# Altium project PortiloopV2Altium_Project.PrjPcb
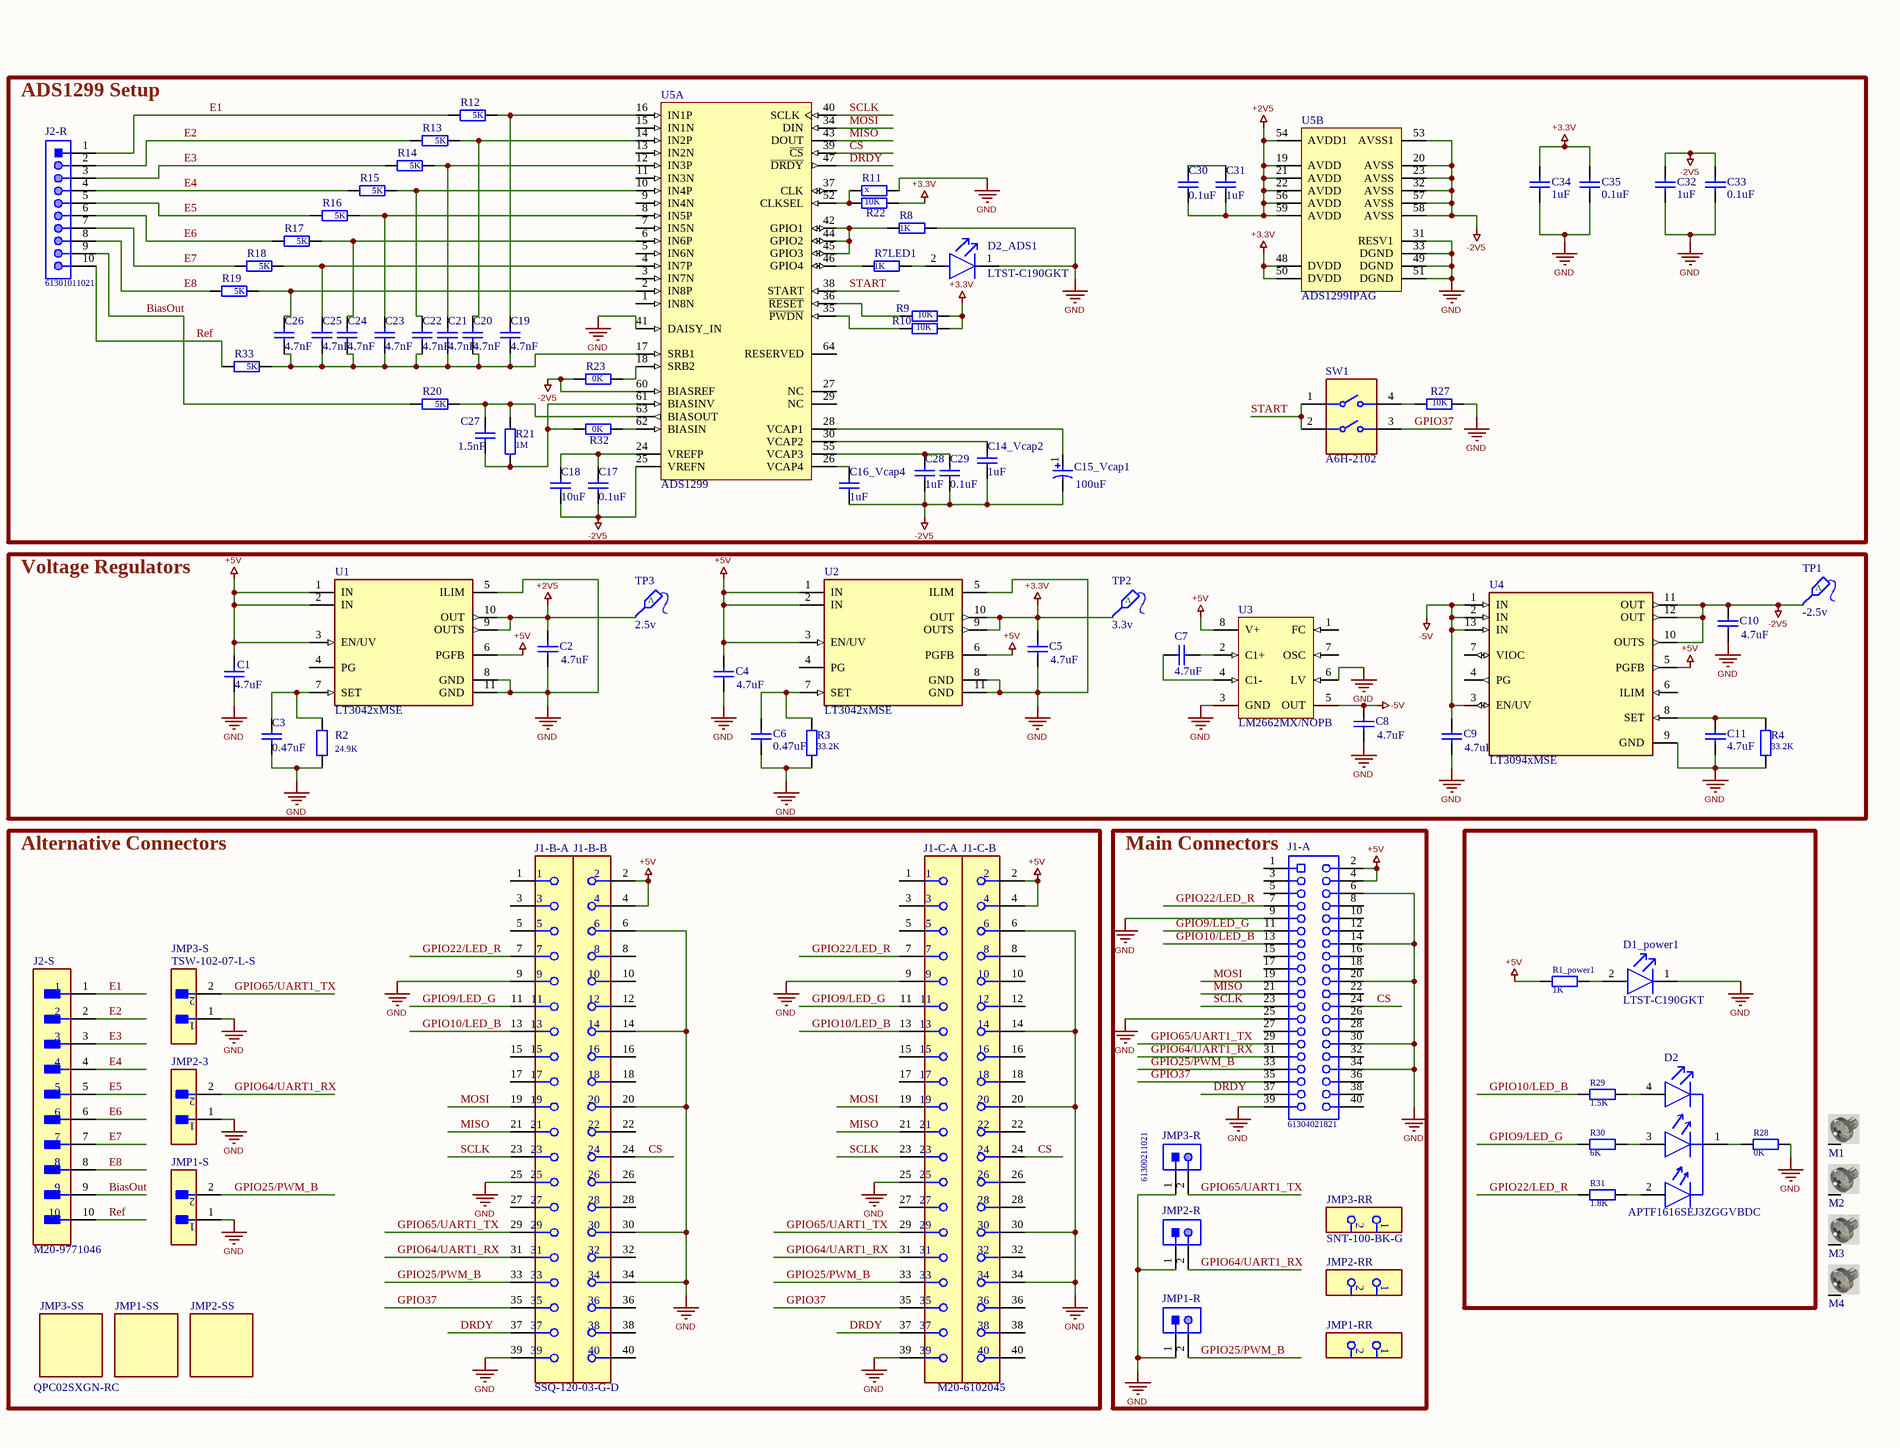
[diagram p0: PortiloopV2Altium_Sch.SchDoc, right]
1 sheet, 94 parts. Net scope: global (net labels, ports and power ports of the same name join across sheets).
Board file: PortiloopV2Altium_PCB.PcbDoc

## Sheet PortiloopV2Altium_Sch.SchDoc
size A3; DrawnBy: Ehsan Marjani; Organization: MIST Lab; SheetNumber: 1; SheetTotal: 1; SPICEModelCacheKUFEERRC: <root> / <DocumentId>KUFEERRC</DocumentId> / <CacheFrame Number="0"> / <Model Name="cap" Kind="MDL"> / <Text>*Default semiconductor capacitor / .MODEL CAP C()</Text> / </Model> / </CacheFrame> / </root>

### Parts
C1  value 4.7uF  [C1206]  (hidden comment: 4.7mkf)
C2  value 4.7uF  [C1206]  (hidden comment: 4.7mkf)
C3  value 0.47uF  [1608[0603]]  (hidden comment: 0.47mkf)
C4  value 4.7uF  [C1206]  (hidden comment: 4.7mkf)
C5  value 4.7uF  [C1206]  (hidden comment: 4.7mkf)
C6  value 0.47uF  [1608[0603]]  (hidden comment: 0.47mkf)
C7  value 4.7uF  [C1206]  (hidden comment: 4.7mkf)
C8  value 4.7uF  [C1206]  (hidden comment: 4.7mkf)
C9  value 4.7uF  [C1206]  (hidden comment: 4.7mkf)
C10  value 4.7uF  [C1206]  (hidden comment: 4.7mkf)
C11  value 4.7uF  [C1206]  (hidden comment: 4.7mkf)
C14_Vcap2  value 1uF  [1608[0603]]  (hidden comment: 1mkf)
C15_Vcap1  Capacitance: 100uF  [KEMT-T491-D_M]  (hidden comment: 100mkf)
C16_Vcap4  value 1uF  [1608[0603]]  (hidden comment: 1mkf)
C17  value 0.1uF  [1608[0603]]  (hidden comment: 0.1mkf)
C18  value 10uF  [C1206]  (hidden comment: 10mkf)
C19  4.7nf  [1608[0603]]
C20  4.7nf  [1608[0603]]
C21  4.7nf  [1608[0603]]
C22  4.7nf  [1608[0603]]
C23  4.7nf  [1608[0603]]
C24  4.7nf  [1608[0603]]
C25  4.7nf  [1608[0603]]
C26  4.7nf  [1608[0603]]
C27  1.5nf  [1608[0603]]
C28  value 1uF  [1608[0603]]  (hidden comment: 1mkf)
C29  value 0.1uF  [1608[0603]]  (hidden comment: 0.1mkf)
C30  value 0.1uF  [1608[0603]]  (hidden comment: 0.1mkf)
C31  value 1uF  [1608[0603]]  (hidden comment: 1mkf)
C32  value 1uF  [1608[0603]]  (hidden comment: 1mkf)
C33  value 0.1uF  [1608[0603]]  (hidden comment: 0.1mkf)
C34  value 1uF  [1608[0603]]  (hidden comment: 1mkf)
C35  value 0.1uF  [1608[0603]]  (hidden comment: 0.1mkf)
D1_power1  LTST-C190GKT  [FP-LTST-C190GKT-MFG]
D2  APTF1616SEJ3ZGGVBDC  [FP-APTF1616SEJ3ZGGVBDC-MFG]
D2_ADS1  LTST-C190GKT  [FP-LTST-C190GKT-MFG]
J1-A  61304021821  [61304021821]
J1-B-  SSQ-120-03-G-D  [FP-SSQ-120-03-G-D-MFG]  (parts A,B of 2)
J1-C-  M20-6102045  [FP-M20-6102045-MFG]  (value not drawn)  (parts A,B of 2)
J2-R  61301011021  [61301011021]
J2-S  M20-9771046  [FP-M20-9771046-MFG]
JMP1-R  61300211021  [61300211021]  (value not drawn)
JMP1-RR  SNT-100-BK-G  [FP-SNT-100-BK-G-MFG]  (value not drawn)
JMP1-S  TSW-102-07-L-S  [FP-TSW-102-07-L-S-MFG]  (value not drawn)
JMP1-SS  QPC02SXGN-RC  [FP-QPC02SXGN-RC-MFG]  (value not drawn)
JMP2-3  TSW-102-07-L-S  [FP-TSW-102-07-L-S-MFG]  (value not drawn)
JMP2-R  61300211021  [61300211021]  (value not drawn)
JMP2-RR  SNT-100-BK-G  [FP-SNT-100-BK-G-MFG]  (value not drawn)
JMP2-SS  QPC02SXGN-RC  [FP-QPC02SXGN-RC-MFG]  (value not drawn)
JMP3-R  61300211021  [61300211021]
JMP3-RR  SNT-100-BK-G  [FP-SNT-100-BK-G-MFG]
JMP3-S  TSW-102-07-L-S  [FP-TSW-102-07-L-S-MFG]
JMP3-SS  QPC02SXGN-RC  [FP-QPC02SXGN-RC-MFG]
M1  Screw  [Board Screw_No Silk]  (value not drawn)
M2  Screw  [Board Screw_No Silk]  (value not drawn)
M3  Screw  [Board Screw_No Silk]  (value not drawn)
M4  Screw  [Board Screw_No Silk]  (value not drawn)
R1_power1  1K  [1608[0603]]
R2  24.9K  [1608[0603]]
R3  33.2K  [1608[0603]]
R4  33.2K  [1608[0603]]
R7LED1  1K  [1608[0603]]
R8  1K  [1608[0603]]
R9  10K  [1608[0603]]
R10  10K  [1608[0603]]
R11  x  [1608[0603]]
R12  5K  [1608[0603]]
R13  5K  [1608[0603]]
R14  5K  [1608[0603]]
R15  5K  [1608[0603]]
R16  5K  [1608[0603]]
R17  5K  [1608[0603]]
R18  5K  [1608[0603]]
R19  5K  [1608[0603]]
R20  5K  [1608[0603]]
R21  1M  [1608[0603]]
R22  10K  [1608[0603]]
R23  0K  [1608[0603]]
R27  10K  [1608[0603]]
R28  0K  [1608[0603]]
R29  1.5K  [1608[0603]]
R30  6K  [1608[0603]]
R31  1.8K  [1608[0603]]
R32  0K  [1608[0603]]
R33  5K  [1608[0603]]
SW1  A6H-2102  [FP-A6H-2102-MFG]
TP1  -2.5v  [TESTPOINT1]
TP2  3.3v  [TESTPOINT1]
TP3  2.5v  [TESTPOINT1]
U1  LT3042xMSE  [FP-MSE-10-05-08-1664-IPC_C]
U2  LT3042xMSE  [FP-MSE-10-05-08-1664-IPC_C]
U3  LM2662MX/NOPB  [D0008A_M]
U4  LT3094xMSE  [FP-MSE-12-05-08-1666-IPC_A]
U5  ADS1299  [PAG0064A_M]  (parts A,B of 2)

### Blocks framed on the sheet
ADS1299 Setup: C14_Vcap2 C15_Vcap1 C16_Vcap4 C17-C35 D2_ADS1 J2-R R7LED1 R8-R23 R27 R32 R33 SW1 U5
Voltage Regulators: C1-C11 R2-R4 TP1-TP3 U1-U4
Alternative Connectors: J1-B- J1-C- J2-S JMP1-S JMP1-SS JMP2-3 JMP2-SS JMP3-S JMP3-SS
Main Connectors: J1-A JMP1-R JMP1-RR JMP2-R JMP2-RR JMP3-R JMP3-RR

### Nets
+2V5: C2.2 C30.2 C31.2 TP3.1(T) U1.9(OUTS) U1.10(OUT) U5.19(AVDD) U5.21(AVDD) U5.22(AVDD) U5.54(AVDD1) U5.56(AVDD) U5.59(AVDD)
+3.3V: C5.2 C34.2 C35.2 R9.1 R10.1 R22.1 TP2.1(T) U2.9(OUTS) U2.10(OUT) U5.48(DVDD) U5.50(DVDD)
+5V: C1.2 C4.2 J1-A.2 J1-A.4 J1-B-.2 J1-B-.4 J1-C-.2 J1-C-.4 R1_power1.2 U1.1(IN) U1.2(IN) U1.3(EN/UV) U1.6(PGFB) U2.1(IN) U2.2(IN) U2.3(EN/UV) U2.6(PGFB) U3.8(V+) U4.5(PGFB)
-2V5: C10.2 C14_Vcap2.1 C15_Vcap1.2 C16_Vcap4.1 C17.2 C18.1 C28.1 C29.1 C32.2 C33.2 R23.2 TP1.1(T) U4.10(OUTS) U4.11(OUT) U4.12(OUT) U5.20(AVSS) U5.23(AVSS) U5.25(VREFN) U5.32(AVSS) U5.53(AVSS1) U5.57(AVSS) U5.58(AVSS) U5.60(BIASREF)
-5V: C8.2 C9.2 U3.5(OUT) U4.1(IN) U4.2(IN) U4.3(EN/UV) U4.13(IN)
GND: C1.1 C2.1 C3.1 C4.1 C5.1 C6.2 C8.1 C9.1 C10.1 C11.1 C32.1 C33.1 C34.1 C35.1 D1_power1.1(C) D2_ADS1.1(C) J1-A.6 J1-A.9 J1-A.14 J1-A.20 J1-A.25 J1-A.30 J1-A.34 J1-A.39 J1-B-.6 J1-B-.9 J1-B-.14 J1-B-.20 J1-B-.25 J1-B-.30 J1-B-.34 J1-B-.39 J1-C-.6 J1-C-.9 J1-C-.14 J1-C-.20 J1-C-.25 J1-C-.30 J1-C-.34 J1-C-.39 JMP1-R.1 JMP1-S.1 JMP2-3.1 JMP2-R.1 JMP3-R.1 JMP3-S.1 R2.2 R3.2 R4.2 R8.2 R11.1 R27.1 R28.1 U1.5(ILIM) U1.8(GND) U1.11(GND) U2.5(ILIM) U2.8(GND) U2.11(GND) U3.3(GND) U3.6(LV) U4.9(GND) U5.31(RESV1) U5.33(DGND) U5.41(DAISY_IN) U5.49(DGND) U5.51(DGND)
BiasOut: J2-R.9 J2-S.9 R20.1
CS: J1-A.24 J1-B-.24 J1-C-.24 U5.39(~{CS})
DRDY: J1-A.37 J1-B-.37 J1-C-.37 U5.47(~{DRDY})
E1: J2-R.1 J2-S.1 R12.1
E2: J2-R.2 J2-S.2 R13.1
E3: J2-R.3 J2-S.3 R14.1
E4: J2-R.4 J2-S.4 R15.1
E5: J2-R.5 J2-S.5 R16.1
E6: J2-R.6 J2-S.6 R17.1
E7: J2-R.7 J2-S.7 R18.1
E8: J2-R.8 J2-S.8 R19.1
GPIO9/LED_G: J1-A.11 J1-B-.11 J1-C-.11 R30.2
GPIO10/LED_B: J1-A.13 J1-B-.13 J1-C-.13 R29.2
GPIO22/LED_R: J1-A.7 J1-B-.7 J1-C-.7 R31.2
GPIO25/PWM_B: J1-A.33 J1-B-.33 J1-C-.33 JMP1-R.2 JMP1-S.2
GPIO37: J1-A.35 J1-B-.35 J1-C-.35 SW1.3
GPIO64/UART1_RX: J1-A.31 J1-B-.31 J1-C-.31 JMP2-3.2 JMP2-R.2
GPIO65/UART1_TX: J1-A.29 J1-B-.29 J1-C-.29 JMP3-R.2 JMP3-S.2
MISO: J1-A.21 J1-B-.21 J1-C-.21 U5.43(DOUT)
MOSI: J1-A.19 J1-B-.19 J1-C-.19 U5.34(DIN)
Ref: J2-R.10 J2-S.10 R33.1
SCLK: J1-A.23 J1-B-.23 J1-C-.23 U5.40(SCLK)
START: SW1.1 SW1.2 U5.38(START)
NetC3_2: C3.2 R2.1 U1.7(SET)
NetC6_1: C6.1 R3.1 U2.7(SET)
NetC7_1: C7.1 U3.4(C1-)
NetC7_2: C7.2 U3.2(C1+)
NetC11_2: C11.2 R4.1 U4.8(SET)
NetC14_Vcap2_2: C14_Vcap2.2 U5.30(VCAP2)
NetC15_Vcap1_1: C15_Vcap1.1 U5.28(VCAP1)
NetC16_Vcap4_2: C16_Vcap4.2 U5.26(VCAP4)
NetC17_1: C17.1 C18.2 U5.24(VREFP)
NetC19_1: C19.1 C20.1 C21.1 C22.1 C23.1 C24.1 C25.1 C26.1 R33.2 U5.17(SRB1)
NetC19_2: C19.2 R12.2 U5.16(IN1P)
NetC20_2: C20.2 R13.2 U5.14(IN2P)
NetC21_2: C21.2 R14.2 U5.12(IN3P)
NetC22_2: C22.2 R15.2 U5.10(IN4P)
NetC23_2: C23.2 R16.2 U5.8(IN5P)
NetC24_2: C24.2 R17.2 U5.6(IN6P)
NetC25_2: C25.2 R18.2 U5.4(IN7P)
NetC26_2: C26.2 R19.2 U5.2(IN8P)
NetC27_1: C27.1 R21.2 R32.2 U5.61(BIASINV)
NetC27_2: C27.2 R20.2 R21.1 U5.63(BIASOUT)
NetC28_2: C28.2 C29.2 U5.55(VCAP3)
NetC30_1: C30.1 C31.1
NetD1_power1_2: D1_power1.2(A) R1_power1.1
NetD2_1: D2.1(COMMON_CATHODE) R28.2
NetD2_2: D2.2(RED_A) R31.1
NetD2_3: D2.3(GREEN_A) R30.1
NetD2_4: D2.4(BLUE_A) R29.1
NetD2_ADS1_2: D2_ADS1.2(A) R7LED1.2
NetR7LED1_1: R7LED1.1 U5.46(GPIO4)
NetR8_1: R8.1 U5.42(GPIO1) U5.44(GPIO2) U5.45(GPIO3)
NetR9_2: R9.2 U5.36(~{RESET})
NetR10_2: R10.2 U5.35(~{PWDN})
NetR11_2: R11.2 R22.2 U5.52(CLKSEL)
NetR23_1: R23.1 U5.18(SRB2)
NetR27_2: R27.2 SW1.4
NetR32_1: R32.1 U5.62(BIASIN)

Not connected (* = marked no-connect by the designer): J1-A 1 3 5 8 10 12 15 16 17 18 22 26 27 28 32 36 38 40; J1-B- 1 3 5 8 10 12 15 16 17 18 22 26 27 28 32 36 38 40; J1-C- 1 3 5 8 10 12 15 16 17 18 22 26 27 28 32 36 38 40; M1 S; M2 S; M3 S; M4 S; U1 4(PG); U2 4(PG); U3 1(FC) 7(OSC); U4 4(PG) 6(ILIM) 7(VIOC); U5 1(IN8N) 3(IN7N) 5(IN6N) 7(IN5N) 9(IN4N) 11(IN3N) 13(IN2N) 15(IN1N) 27(NC) 29(NC) 37(CLK) 64(RESERVED)

### Notes on the sheet
- (in symbol Test Point) v

### Library data of the parts
C1-C11 C14_Vcap2 C16_Vcap4 C17-C35 = Cap Semi: Published: 8-Jun-2000; LatestRevisionDate: 29-May-2009; LatestRevisionNote: IPC-7351 Footprint Added.; PackageReference: C1206; Publisher: Altium Limited; PackageDescription: Chip Capacitor
  C19-C26: Value: 4.7nF
  C27: Value: 1.5nF
C15_Vcap1 = CMP-1664-00011-1: Capacitor, Tantalum, 100 uF, +/- 10%, -55 to 125 degC, 2-Pin SMD, RoHS, Tape and Reel; Voltage Rating: 50 V; Case\Package: Radial; Tolerance: 20%; Lead Pitch: 2 mm; PackageReference: T491-D; REACH SVHC: No SVHC; Diameter: 5 mm; Pins: 2; PackageDescription: 2-Pin Surface Mount Device, Body 7.3 x 4.3 mm; ComponentLink1URL: http://www.kemet.com/; ComponentLink2URL: http://www.kemet.com/Lists/ProductCatalog/Attachments/254/KEM_T2005_T491.pdf; Packaging: Bulk; DatasheetVersion: Jun-16; Radiation Hardening: No; Voltage Rating (DC): 50 V; ComponentLink2Description: Datasheet; Height: 11 mm; RoHSCompliant: true; Min Operating Temperature: -40 degC; Mount: Through Hole; Max Operating Temperature: 85 degC; Package Quantity: 200; Length: 11 mm; ComponentLink1Description: Manufacturer URL
D1_power1 D2_ADS1 = CMP-22017-000005-2: LED GREEN CLEAR CHIP SMD; Dominant Wavelength: 569nm; Reverse Voltage: 5V; Lens Color: Colorless; Viewing Angle: 130°; Voltage: 2V; Forward Current: 30mA; Power Dissipation: 100mW; Luminous Intensity: 6mcd; Number of LEDs: 1; Forward Voltage: 2.1V; Wavelength: 565nm; Test Current: 10mA; Min Operating Temperature: -55°C; Lens Style: Clear; Mount: Surface Mount; Width: 0.8mm; Packaging: Tape and Reel; Lens Transparency: Clear; Case Code (Metric): 1608; Depth: 0.8mm; Case Code (Imperial): 0603; Case/Package: 0603; Number of Pins: 2; Max Operating Temperature: 85°C; Lead Free: Lead Free; Number of Elements: 1; Length: 1.6mm; Height: 0.8mm; Package Quantity: 1; Power Rating: 100mW; Radiation Hardening: No; Illumination Color: Green; Color: Green
D2 = CMP-44529-000025-1: LED RGB CLEAR 4SMD; Luminous Intensity: 140mcd; Test Current: 20mA; Forward Voltage: 3.3V; Lens Color: Colorless; Illumination Color: Blue; Viewing Angle: 120°; Dominant Wavelength: 470nm; Width: 1.6mm; Mount: Surface Mount; Height: 0.9mm; Case/Package: 0606; Max Operating Temperature: 85°C; Color: Blue; Lens Transparency: Clear; Min Operating Temperature: -40°C; Forward Current: 20mA; Length: 1.6mm; Packaging: Tape and Reel; Package Quantity: 2000
J1-A = CMP-1502-01370-1: THT Vertical Socket Header WR-PHD, Pitch 2.54 mm, Dual Row, 40 pins; Manufacturer: Wurth Elektronik; Pitch: 2.54mm; Withstanding Voltage: 500VAC; Rated Current: 3A; Gender: Female; Working Voltage: 250VAC; Pin Number: 40; Contact Resistance: 20mOhm; Datasheet URL: https://katalog.we-online.de/em/datasheet/6130xx21821.pdf; Operating Temperature: -40to125degC; Row Number: Dual; Mounting Technology: THT; Package Reference: 61304021821; Orientation: Vertical; Part Number: 61304021821; Manufacturer URL: http://www.we-online.de; Publisher: WurthElektronik; Packaging: Tray
J1-B- = CMP-02766-001530-1: CONN RCPT 40POS 0.1 GOLD PCB; Pitch: 0.1inch; Connector Type: Receptacle; Number of Contacts: 40; Contact Resistance: 10mR; Max Voltage Rating (AC): 550V; Gender: Female; Max Current Rating: 7.6A; RoHS Compliant: Yes; Contact Material: Bronze; Length: 51.31mm; Lead Free: Lead Free; Depth: 4.95mm; Width: 4.95mm; Packaging: Bulk; Mount: Through Hole; Contact Plating: Gold; Orientation: Straight; Contact Type: Female Socket; Min Operating Temperature: -55°C; Color: Black; Max Operating Temperature: 125°C; Radiation Hardening: No; Row Spacing: 0.1inch; Number of Positions: 40; Housing Material: Polymer; Termination: Solder; Housing Color: Black; Number of Rows: 2; Series: SSQ
J1-C- = CMP-15831-000080-1: CONN STKTHRU PC/104 40POS PCB; Current Rating: 3A; Pitch: 2.54mm; Insulation Resistance: 5GR; Contact Resistance: 30mR; Number of Positions: 40; Gender: Receptacle; REACH SVHC: No SVHC; Housing Material: Nylon; Number of Rows: 2; Min Operating Temperature: -55°C; Contact Plating: Gold; Orientation: Straight; Mount: Through Hole; Contact Material: Bronze; Length: 51.46mm; Weight: 0.218205oz; Number of Contacts: 40; Packaging: Rail/Tube; Depth: 5.25mm; Termination: Solder; Radiation Hardening: No; Flammability Rating: UL94 V-0; Housing Color: Black; Max Operating Temperature: 105°C; Material: Nylon; Package Quantity: 11; Color: Black; Max Current Rating: 3A; Series: M20
J2-R = CMP-1502-01081-1: THT Angled Pin Header WR-PHD, Pitch 2.54 mm, Single Row, 10 pins; Manufacturer: Wurth Elektronik; Contact Resistance: 20mOhm; Pitch: 2.54mm; Gender: Male; Withstanding Voltage: 500VAC; Rated Current: 3A; Working Voltage: 250VAC; Pin Number: 10; Manufacturer URL: http://www.we-online.de; Package Reference: 61301011021; Publisher: WurthElektronik; Part Number: 61301011021; Datasheet URL: https://katalog.we-online.de/em/datasheet/6130xx11021.pdf; Packaging: Bag; Row Number: Single; Orientation: Angled; Mounting Technology: THT; Operating Temperature: -40to105degC
J2-S = CMP-15831-000029-1: CONN HEADER VERT 10POS 2.54MM; Gender: Male; Number of Positions: 10; Connector Type: Male Pin; Voltage Rating: 750V; Current Rating: 3A; Contact Plating: Tin; Mount: Through Hole; Radiation Hardening: No; Packaging: Bulk; Pitch: 2.54mm; Number of Rows: 1; Series: M20; Contact Type: Male Pin; Color: Black; Package Quantity: 500; Contact Mating Length: 0.228inch; Case/Package: SIL; Termination: Solder; Number of Contacts: 10; Housing Material: Nylon; Contact Material: Brass
JMP1-R JMP2-R JMP3-R = CMP-1502-01059-1: THT Angled Pin Header WR-PHD, Pitch 2.54 mm, Single Row, 2 pins; Manufacturer: Wurth Elektronik; Withstanding Voltage: 500VAC; Gender: Male; Pitch: 2.54mm; Pin Number: 2; Rated Current: 3A; Contact Resistance: 20mOhm; Working Voltage: 250VAC; Mounting Technology: THT; Part Number: 61300211021; Manufacturer URL: http://www.we-online.de; Operating Temperature: -40to105degC; Row Number: Single; Publisher: WurthElektronik; Orientation: Angled; Datasheet URL: https://katalog.we-online.de/em/datasheet/6130xx11021.pdf; Packaging: Bag; Package Reference: 61300211021
JMP1-RR JMP2-RR JMP3-RR = CMP-02752-000005-1: CONN SHUNT 2POS; Number of Positions: 2; Max Current Rating: 2.5A; Pitch: 2.54mm; Contact Resistance: 5mR; Min Operating Temperature: -55°C; Number of Rows: 1; Housing Color: Black; Package Quantity: 1; Depth: 2.54mm; Housing Material: Polyester; Series: SNT; RoHS Compliant: Yes; Orientation: Straight; Radiation Hardening: No; Number of Contacts: 2; REACH SVHC: No SVHC; Length: 5.08mm; Contact Plating: Gold; Max Operating Temperature: 125°C; Color: Black; Packaging: Bulk; Height: 0.24inch; Contact Material: Bronze
JMP1-S JMP2-3 JMP3-S = CMP-02766-001428-1: CONN HEADER VERT 2POS 2.54MM; Voltage Rating: 550V; Current Rating: 7.6A; Gender: Male; Number of Contacts: 2; Connector Type: Male Pin; Radiation Hardening: No; Orientation: Straight; Contact Plating: Gold; Max Operating Temperature: 125°C; Mount: Through Hole; Package Quantity: 1; Number of Rows: 1; Housing Material: Polyester; RoHS Compliant: Yes; Length: 5.08mm; Max Voltage Rating (AC): 550V; Pitch: 2.54mm; Packaging: Bulk; Depth: 2.54mm; Termination: Solder; Min Operating Temperature: -55°C; Housing Color: Black; Lead Free: Lead Free; Color: Black; Number of Positions: 2; Width: 2.54mm; Max Current Rating: 7.6A; REACH SVHC: No SVHC; Contact Material: Bronze; Contact Mating Length: 0.23inch; Series: TSW; Contact Type: Male Pin
JMP1-SS JMP2-SS JMP3-SS = CMP-25666-000001-1: CONN JUMPER SHORTING .100" GOLD; Manufacturer: Sullins; Conn Orientation: Straight; Pitch: 2.54mm; Current Rating: 3A; Number Of Contacts: 2; Category: Conn; Temperature Range Low: -40°C; Temperature Range High: +85°C; Device Class L1: Connectors; Lead Free: Yes; Manufacturer Part Number: QPC02SXGN-RC; Automotive: No; Height: 6.17mm; ComponentLink2URL: https://s3.amazonaws.com/catalogspreads-pdf/PAGE128-129%20.100%20JUMPER.pdf; Device Class L2: unset; Footprint Url: https://drawings-pdf.s3.amazonaws.com/11510.pdf; Device Class L3: unset; Temperature: -40°C to +85°C; RoHS: TRUE; Digikey Description: CONN JUMPER SHORTING .100" GOLD; Octopart: https://octopart.com/qpc02sxgn-rc-sullins-19878795; Package: 0; ComponentLink2Description: Datasheet; Contact Material: Gold
M1-M4 = Board Screw: Board Screw With Spacer
R1_power1 R2-R4 R7LED1 R8-R10 R12-R23 R27-R33 = Res2: Resistor; Published: 8-Jun-2000; LatestRevisionDate: 17-Jul-2002; LatestRevisionNote: Re-released for DXP Platform.; PackageReference: AXIAL-0.4; Publisher: Altium Limited; PackageDescription: Axial Device, Thru-Hole; 2 Leads; 0.4 in Pin Spacing
  R1_power1 R7LED1 R8: Value: 1K
  R2: Value: 24.9K
  R3 R4: Value: 33.2K
  R9 R10 R22 R27: Value: 10K
  R12-R20 R33: Value: 5K
  R21: Value: 1M
  R23 R28 R32: Value: 0K
  R29: Value: 1.5K
  R30: Value: 6K
  R31: Value: 1.8K
R11 = Res2: Not Connected; Published: 8-Jun-2000; LatestRevisionDate: 17-Jul-2002; LatestRevisionNote: Re-released for DXP Platform.; PackageReference: AXIAL-0.4; Publisher: Altium Limited; PackageDescription: Axial Device, Thru-Hole; 2 Leads; 0.4 in Pin Spacing; Value: x
SW1 = CMP-08827-000068-1: SWITCH SLIDE DIP SPST 25MA 24V; Washable: Yes; Number of Circuits: 2; Actuator Type: Slide (Standard); Contact Resistance: 200mR; Pitch: 0.05inch; Mechanical Life: 1000Cycles; Actuator Length: 0mm; Number of Poles: 8; Weight: 0.06g; Orientation: Straight; Case/Package: DIP; Contact Current Rating: 25mA; Termination: Gull Wing; Package Quantity: 75; Series: A6H; Number of Positions: 2; Current Rating: 25mA; Throw Configuration: SPST; Height: 1.55mm; Max Current Rating: 25mA; Length: 0.148inch; RoHS Compliant: Yes; Voltage Rating (DC): 24V; Mount: Surface Mount; Max Voltage Rating (DC): 24V; Max Operating Temperature: 70°C; Terminal Pitch: 1.27mm; Packaging: Rail/Tube; Electrical Life: 1000Cycles; Min Operating Temperature: -20°C; Width: 4.5mm
TP1-TP3 = Test Point
U1 U2 = CMP-09138-000246-1: IC REG LIN POS ADJ 200MA 10MSOP; Min Input Voltage: 1.8V; Max Output Voltage: 15V; Dropout Voltage: 350mV; Output Type: Adjustable; Max Input Voltage: 20V; Number of Regulators: 1; Min Output Voltage: 0V; Min Current Limit: 220mA; Output Current: 200mA; REACH SVHC: No SVHC; Max Operating Temperature: 125°C; Packaging: Rail/Tube; RoHS Compliant: Yes; Output Voltage: 15V; Number of Pins: 10; Mount: Surface Mount; Min Operating Temperature: -40°C; Series: -; Case/Package: MSOP
U3 = CMP-0065-00025-3: Switched Capacitor Voltage Converter, 8-pin Narrow SOIC, Pb-Free; Manufacturer: Texas Instruments; PowerWise: N; CompType: Switch Caps; PackageTopMarking: NSZXTT*LM26*62M; PackageReference: D0008A; PinCount: 8; RoHS: Y; ComponentLink1URL: http://www.ti.com/general/docs/lit/getliterature.tsp?genericPartNumber=LM2662&fileType=pdf; Code_IPC: SOIC127P600-8; ComponentLink1Description: Datasheet URL; PackageDescription: SOIC Narrow, 4.9 x 3.9 x 1.45mm, 8 Lead, 1.27mm Pitch; Code_JEDEC: MS-012-AA
U4 = CMP-09138-000085-1: IC REG LIN NEG ADJ 500MA 12MSOP; RoHS Compliant: Yes
U5 = CMP-0841-00002-2: Low-Noise, 8-Channel, 24-Bit Analog Front-End for Biopotential Measurement, 16 KSPS, -40 to 85 degC, 64-Pin PQFP (PAG-64), RoHS, Tube; PartNumber: ADS1299IPAG; Manufacturer: Texas Instruments; Architecture: Delta-Sigma; Reference Mode: Int, Ext; # Input Channels: 8; Resolution (Bits): 24; Sample Rate (max) (KSPS): 16; Interface: Serial SPI; Packing: PAG0064A; PackageVersion: 4040282/C; PackageReference: PAG-64; ComponentLink3Description: Package Specification; DatasheetVersion: SBAS499A; ComponentLink1Description: Manufacturer URL; ComponentLink2Description: Datasheet; PackageDescription: 64-Pin Plastic Quad Flatpack, Body 10 x 10 mm, Pitch 0.5 mm; RoHS: TRUE; Operating Temperature Range (C): -40 to 85; ComponentLink3URL: http://www.ti.com/lit/ml/mtqf006a/mtqf006a.pdf; ComponentLink1URL: http://www.ti.com/; ComponentLink2URL: http://www.ti.com/lit/ds/symlink/ads1299.pdf; Mounting Technology: Surface Mount